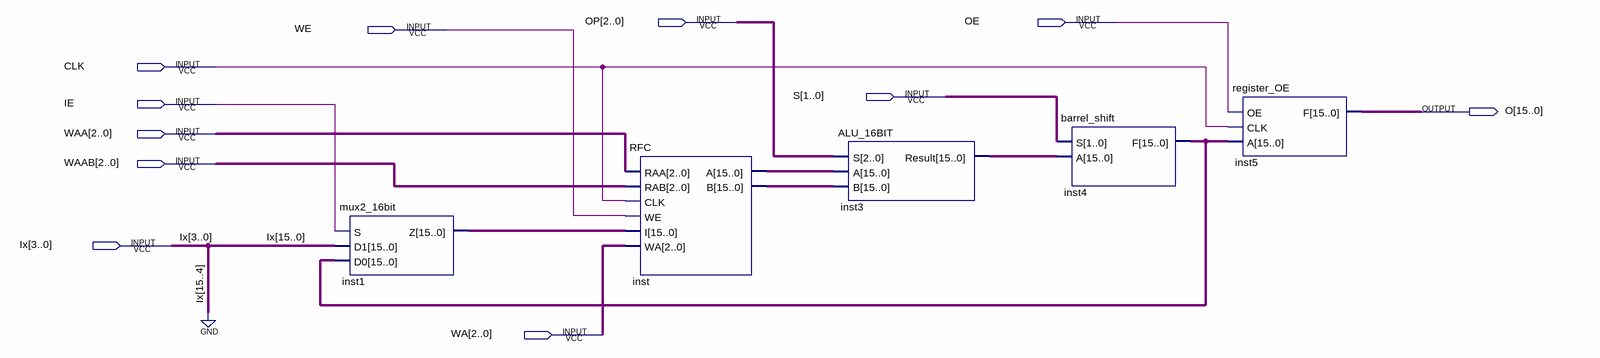
[diagram p0: schematic sheet]
// Quartus schematic Datatpath.bdf as structural Verilog: 5 symbols, 11 pins
module Datatpath (
  input  [2:0] OP,
  input  OE,
  input  WE,
  input  CLK,
  input  [1:0] S,
  input  IE,
  input  [2:0] WAA,
  input  [2:0] WAAB,
  input  [3:0] Ix,
  input  [2:0] WA,
  output [15:0] O
);

  wire [15:0] inst1_z, inst3_result, inst4_f, inst_a, inst_b;

  mux2_16bit inst1 (.S(IE), .D1({{12{1'b0}}, Ix}), .D0(inst4_f), .Z(inst1_z));
  RFC inst (.RAA(WAA), .RAB(WAAB), .CLK(CLK), .WE(WE), .I(inst1_z), .WA(WA), .A(inst_a), .B(inst_b));
  ALU_16BIT inst3 (.S(OP), .A(inst_a), .B(inst_b), .Result(inst3_result));
  barrel_shift inst4 (.S(S), .A(inst3_result), .F(inst4_f));
  register_OE inst5 (.OE(OE), .CLK(CLK), .A(inst4_f), .F(O));
endmodule
